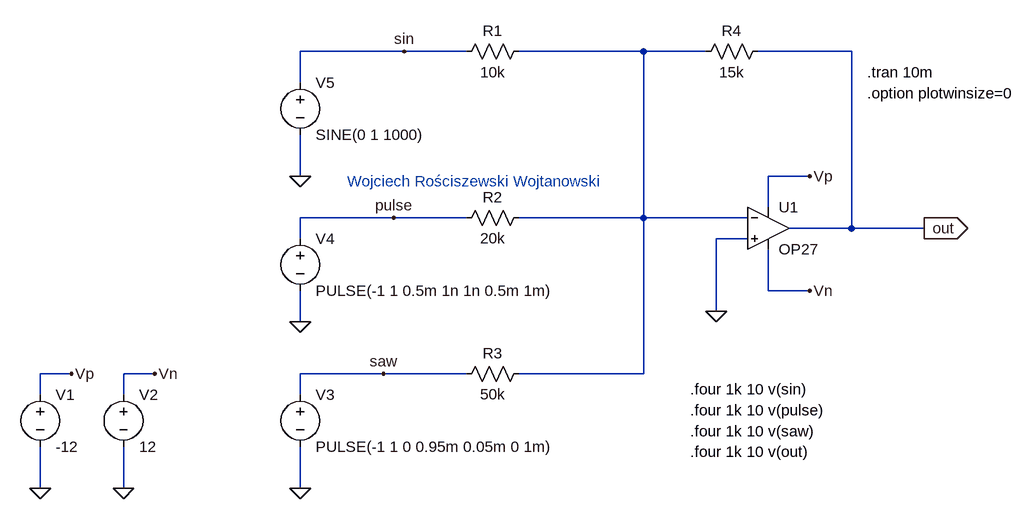
[diagram p0: schematic Analog voltage adder2.asc]
Analog voltage adder2.asc, the LTspice schematic file:
Version 4
SHEET 1 1000 680
WIRE 32 -416 -128 -416
WIRE 128 -416 32 -416
WIRE 400 -416 208 -416
WIRE 496 -416 400 -416
WIRE 720 -416 576 -416
WIRE -128 -368 -128 -416
WIRE -128 -224 -128 -288
WIRE 656 -224 592 -224
WIRE 592 -176 592 -224
WIRE 16 -160 -128 -160
WIRE 128 -160 16 -160
WIRE 400 -160 400 -416
WIRE 400 -160 208 -160
WIRE 560 -160 400 -160
WIRE 720 -144 720 -416
WIRE 720 -144 624 -144
WIRE 832 -144 720 -144
WIRE -128 -128 -128 -160
WIRE 560 -128 512 -128
WIRE 592 -48 592 -112
WIRE 656 -48 592 -48
WIRE 512 -16 512 -128
WIRE -128 0 -128 -48
WIRE -480 80 -528 80
WIRE -352 80 -400 80
WIRE 0 80 -128 80
WIRE 128 80 0 80
WIRE 400 80 400 -160
WIRE 400 80 208 80
WIRE -528 112 -528 80
WIRE -400 112 -400 80
WIRE -128 112 -128 80
WIRE -528 256 -528 192
WIRE -400 256 -400 192
WIRE -128 256 -128 192
FLAG -400 256 0
FLAG -528 256 0
FLAG -128 -224 0
FLAG -128 0 0
FLAG -128 256 0
FLAG 512 -16 0
FLAG 832 -144 out
IOPIN 832 -144 Out
FLAG 656 -224 Vp
FLAG 656 -48 Vn
FLAG 32 -416 sin
FLAG 16 -160 pulse
FLAG 0 80 saw
FLAG -480 80 Vp
FLAG -352 80 Vn
SYMBOL voltage -528 96 R0
WINDOW 123 0 0 Left 0
WINDOW 39 0 0 Left 0
SYMATTR InstName V1
SYMATTR Value -12
SYMBOL voltage -400 96 R0
WINDOW 123 0 0 Left 0
WINDOW 39 0 0 Left 0
SYMATTR InstName V2
SYMATTR Value 12
SYMBOL voltage -128 96 R0
WINDOW 123 0 0 Left 0
WINDOW 39 0 0 Left 0
SYMATTR InstName V3
SYMATTR Value PULSE(-1 1 0 0.95m 0.05m 0 1m)
SYMBOL voltage -128 -144 R0
WINDOW 123 0 0 Left 0
WINDOW 39 0 0 Left 0
SYMATTR InstName V4
SYMATTR Value PULSE(-1 1 0.5m 1n 1n 0.5m 1m)
SYMBOL voltage -128 -384 R0
WINDOW 123 0 0 Left 0
WINDOW 39 0 0 Left 0
SYMATTR InstName V5
SYMATTR Value SINE(0 1 1000)
SYMBOL res 224 -432 R90
WINDOW 0 0 56 VBottom 2
WINDOW 3 32 56 VTop 2
SYMATTR InstName R1
SYMATTR Value 10k
SYMBOL res 224 -176 R90
WINDOW 0 0 56 VBottom 2
WINDOW 3 32 56 VTop 2
SYMATTR InstName R2
SYMATTR Value 20k
SYMBOL res 224 64 R90
WINDOW 0 0 56 VBottom 2
WINDOW 3 32 56 VTop 2
SYMATTR InstName R3
SYMATTR Value 50k
SYMBOL res 592 -432 R90
WINDOW 0 0 56 VBottom 2
WINDOW 3 32 56 VTop 2
SYMATTR InstName R4
SYMATTR Value 15k
SYMBOL Opamps\\OP27 592 -208 R0
SYMATTR InstName U1
TEXT 744 -384 Left 2 !.tran 10m
TEXT 744 -352 Left 2 !.option plotwinsize=0
TEXT -56 -216 Left 2 ;Wojciech Rościszewski Wojtanowski
TEXT 472 104 Left 2 !.four 1k 10 v(sin)
TEXT 472 136 Left 2 !.four 1k 10 v(pulse)
TEXT 472 168 Left 2 !.four 1k 10 v(saw)
TEXT 472 200 Left 2 !.four 1k 10 v(out)

The netlist it stands for:
* Analog voltage adder2.asc
V1 Vp 0 -12
V2 Vn 0 12
V3 saw 0 PULSE(-1 1 0 0.95m 0.05m 0 1m)
V4 pulse 0 PULSE(-1 1 0.5m 1n 1n 0.5m 1m)
V5 sin 0 SINE(0 1 1000)
R1 N001 sin 10k
R2 N001 pulse 20k
R3 N001 saw 50k
R4 out N001 15k
XU1 0 N001 Vp Vn out OP27  ; pins In+ In- V+ V- OUT
.tran 10m
.option plotwinsize=0
* Wojciech Rościszewski Wojtanowski
.four 1k 10 v(sin)
.four 1k 10 v(pulse)
.four 1k 10 v(saw)
.four 1k 10 v(out)
.lib ADI.lib
.backanno
.end